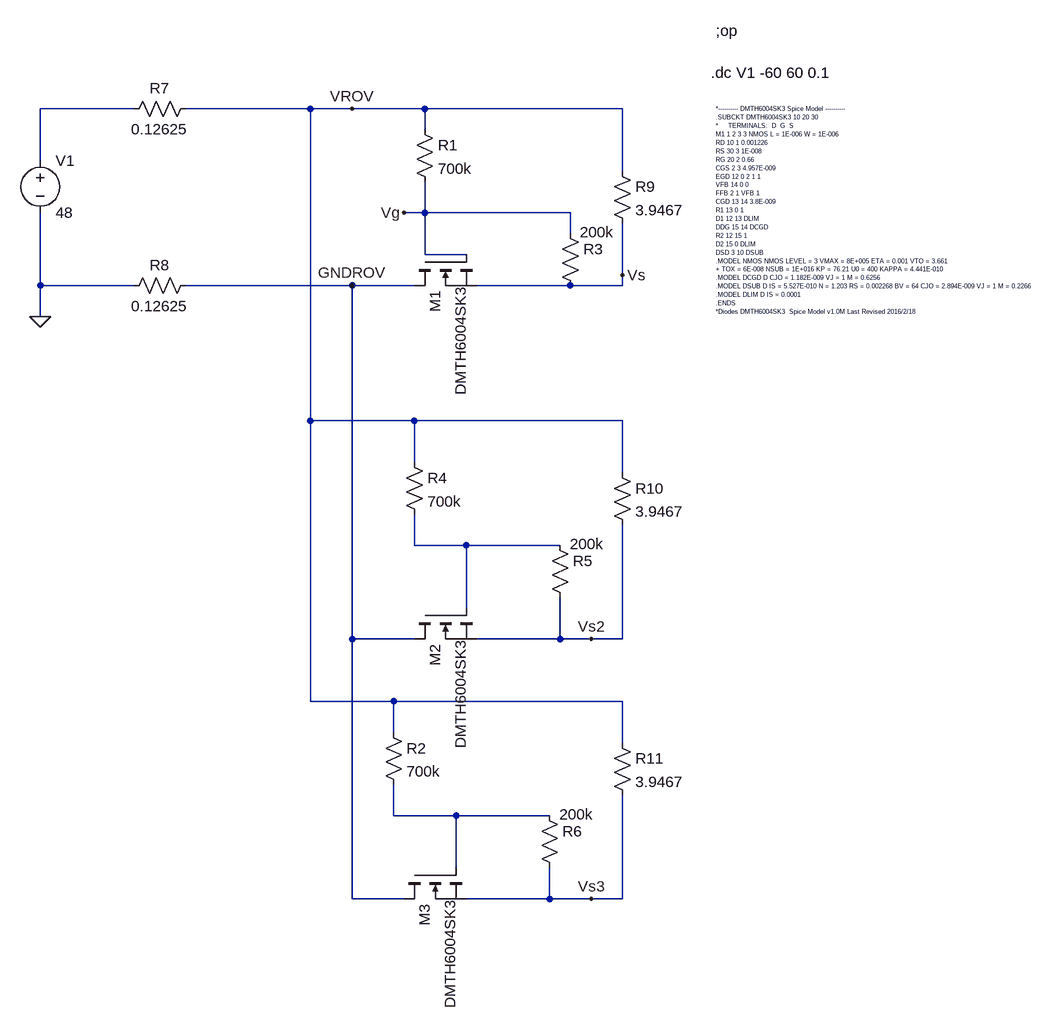
[diagram p0: schematic Reverse Voltage Protection Full System.asc]
Reverse Voltage Protection Full System.asc, the LTspice schematic file:
Version 4
SHEET 1 1812 680
WIRE -320 -896 -464 -896
WIRE -48 -896 -240 -896
WIRE 16 -896 -48 -896
WIRE 128 -896 16 -896
WIRE 432 -896 128 -896
WIRE 128 -864 128 -896
WIRE -464 -816 -464 -896
WIRE 432 -800 432 -896
WIRE 128 -736 128 -784
WIRE 128 -736 96 -736
WIRE 352 -736 128 -736
WIRE 352 -704 352 -736
WIRE 128 -672 128 -736
WIRE 192 -672 128 -672
WIRE 432 -640 432 -720
WIRE -464 -624 -464 -736
WIRE -320 -624 -464 -624
WIRE 16 -624 -240 -624
WIRE 112 -624 16 -624
WIRE 352 -624 208 -624
WIRE 432 -624 432 -640
WIRE 432 -624 352 -624
WIRE -464 -576 -464 -624
WIRE -48 -416 -48 -896
WIRE 112 -416 -48 -416
WIRE 432 -416 112 -416
WIRE 112 -352 112 -416
WIRE 432 -336 432 -416
WIRE 112 -224 112 -272
WIRE 192 -224 112 -224
WIRE 336 -224 192 -224
WIRE 192 -128 192 -224
WIRE 16 -80 16 -624
WIRE 112 -80 16 -80
WIRE 336 -80 336 -144
WIRE 336 -80 208 -80
WIRE 384 -80 336 -80
WIRE 432 -80 432 -256
WIRE 432 -80 384 -80
WIRE -48 16 -48 -416
WIRE 80 16 -48 16
WIRE 432 16 80 16
WIRE 80 64 80 16
WIRE 432 80 432 16
WIRE 80 192 80 144
WIRE 176 192 80 192
WIRE 320 192 176 192
WIRE 176 272 176 192
WIRE 16 320 16 -80
WIRE 96 320 16 320
WIRE 320 320 320 272
WIRE 320 320 192 320
WIRE 384 320 320 320
WIRE 432 320 432 160
WIRE 432 320 384 320
FLAG -464 -576 0
FLAG 432 -640 Vs
FLAG 96 -736 Vg
FLAG 16 -896 VROV
FLAG 16 -624 GNDROV
FLAG 384 -80 Vs2
FLAG 384 320 Vs3
SYMBOL voltage -464 -832 R0
WINDOW 123 0 0 Left 2
WINDOW 39 0 0 Left 2
SYMATTR InstName V1
SYMATTR Value 48
SYMBOL nmos 112 -672 M90
WINDOW 3 48 71 Left 2
SYMATTR Value DMTH6004SK3
SYMATTR InstName M1
SYMATTR Prefix X
SYMBOL res 112 -880 R0
SYMATTR InstName R1
SYMATTR Value 700k
SYMBOL res 336 -720 R0
WINDOW 3 31 14 Left 2
SYMATTR Value 200k
SYMATTR InstName R3
SYMBOL nmos 112 -128 M90
WINDOW 3 48 71 Left 2
SYMATTR Value DMTH6004SK3
SYMATTR InstName M2
SYMATTR Prefix X
SYMBOL nmos 96 272 M90
WINDOW 3 48 71 Left 2
SYMATTR Value DMTH6004SK3
SYMATTR InstName M3
SYMATTR Prefix X
SYMBOL res 96 -368 R0
SYMATTR InstName R4
SYMATTR Value 700k
SYMBOL res 320 -240 R0
WINDOW 3 31 14 Left 2
SYMATTR Value 200k
SYMATTR InstName R5
SYMBOL res 64 48 R0
SYMATTR InstName R2
SYMATTR Value 700k
SYMBOL res 304 176 R0
WINDOW 3 31 14 Left 2
SYMATTR Value 200k
SYMATTR InstName R6
SYMBOL res -224 -912 R90
WINDOW 0 0 56 VBottom 2
WINDOW 3 32 56 VTop 2
SYMATTR InstName R7
SYMATTR Value 0.12625
SYMBOL res -224 -640 R90
WINDOW 0 0 56 VBottom 2
WINDOW 3 32 56 VTop 2
SYMATTR InstName R8
SYMATTR Value 0.12625
SYMBOL res 416 -816 R0
SYMATTR InstName R9
SYMATTR Value 3.9467
SYMBOL res 416 -352 R0
SYMATTR InstName R10
SYMATTR Value 3.9467
SYMBOL res 416 64 R0
SYMATTR InstName R11
SYMATTR Value 3.9467
TEXT 576 -1016 Left 2 !;op
TEXT 568 -952 Left 2 !.dc V1 -60 60 0.1
TEXT 576 -896 Left 0 !*---------- DMTH6004SK3 Spice Model ----------\n.SUBCKT DMTH6004SK3 10 20 30 \n*     TERMINALS:  D  G  S\nM1 1 2 3 3 NMOS L = 1E-006 W = 1E-006 \nRD 10 1 0.001226 \nRS 30 3 1E-008 \nRG 20 2 0.66 \nCGS 2 3 4.957E-009 \nEGD 12 0 2 1 1 \nVFB 14 0 0 \nFFB 2 1 VFB 1 \nCGD 13 14 3.8E-009 \nR1 13 0 1 \nD1 12 13 DLIM \nDDG 15 14 DCGD \nR2 12 15 1 \nD2 15 0 DLIM \nDSD 3 10 DSUB \n.MODEL NMOS NMOS LEVEL = 3 VMAX = 8E+005 ETA = 0.001 VTO = 3.661 \n+ TOX = 6E-008 NSUB = 1E+016 KP = 76.21 U0 = 400 KAPPA = 4.441E-010 \n.MODEL DCGD D CJO = 1.182E-009 VJ = 1 M = 0.6256 \n.MODEL DSUB D IS = 5.527E-010 N = 1.203 RS = 0.002268 BV = 64 CJO = 2.894E-009 VJ = 1 M = 0.2266 \n.MODEL DLIM D IS = 0.0001 \n.ENDS\n*Diodes DMTH6004SK3  Spice Model v1.0M Last Revised 2016/2/18

The netlist it stands for:
* Reverse Voltage Protection Full System.asc
V1 N001 0 48
XM1 GNDROV Vg Vs DMTH6004SK3  ; pins D G S
R1 VROV Vg 700k
R3 Vg Vs 200k
XM2 GNDROV N002 Vs2 DMTH6004SK3  ; pins D G S
XM3 GNDROV N003 Vs3 DMTH6004SK3  ; pins D G S
R4 VROV N002 700k
R5 N002 Vs2 200k
R2 VROV N003 700k
R6 N003 Vs3 200k
R7 VROV N001 0.12625
R8 GNDROV 0 0.12625
R9 VROV Vs 3.9467
R10 VROV Vs2 3.9467
R11 VROV Vs3 3.9467
;op
.dc V1 -60 60 0.1
*---------- DMTH6004SK3 Spice Model ----------
.SUBCKT DMTH6004SK3 10 20 30
*     TERMINALS:  D  G  S
M1 1 2 3 3 NMOS L = 1E-006 W = 1E-006
RD 10 1 0.001226
RS 30 3 1E-008
RG 20 2 0.66
CGS 2 3 4.957E-009
EGD 12 0 2 1 1
VFB 14 0 0
FFB 2 1 VFB 1
CGD 13 14 3.8E-009
R1 13 0 1
D1 12 13 DLIM
DDG 15 14 DCGD
R2 12 15 1
D2 15 0 DLIM
DSD 3 10 DSUB
.MODEL NMOS NMOS LEVEL = 3 VMAX = 8E+005 ETA = 0.001 VTO = 3.661
+ TOX = 6E-008 NSUB = 1E+016 KP = 76.21 U0 = 400 KAPPA = 4.441E-010
.MODEL DCGD D CJO = 1.182E-009 VJ = 1 M = 0.6256
.MODEL DSUB D IS = 5.527E-010 N = 1.203 RS = 0.002268 BV = 64 CJO = 2.894E-009 VJ = 1 M = 0.2266
.MODEL DLIM D IS = 0.0001
.ENDS
*Diodes DMTH6004SK3  Spice Model v1.0M Last Revised 2016/2/18
.backanno
.end

* Results of the author's LTspice run, read from the files saved beside the schematic
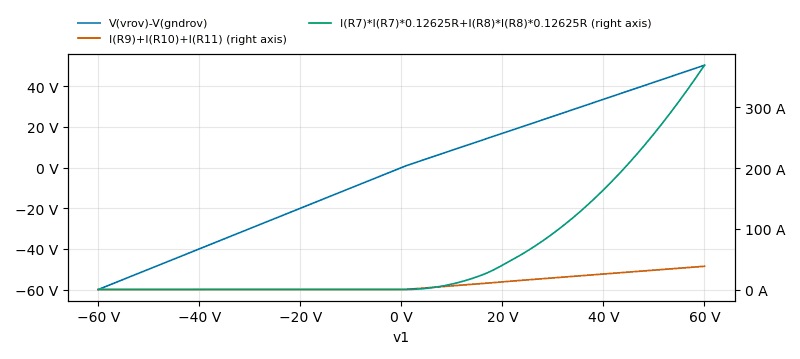
[diagram p1: DC transfer characteristic of Reverse Voltage Protection Full System.asc, plotted from the saved traces]
* DC transfer characteristic, 1 run:
*   V(vrov)-V(gndrov): -60 V at v1=-60 V, 50.34 V at v1=60 V, min -60 V, max 50.34 V
*   I(R9)+I(R10)+I(R11): 137.6 nA at v1=-60 V, 38.24 A at v1=60 V, min -1.174 nA, max 38.24 A
*   I(R7)*I(R7)*0.12625R+I(R8)*I(R8)*0.12625R: 2.391 fA at v1=-60 V, 369.2 A at v1=60 V, min 1.995e-25 fA, max 369.2 A